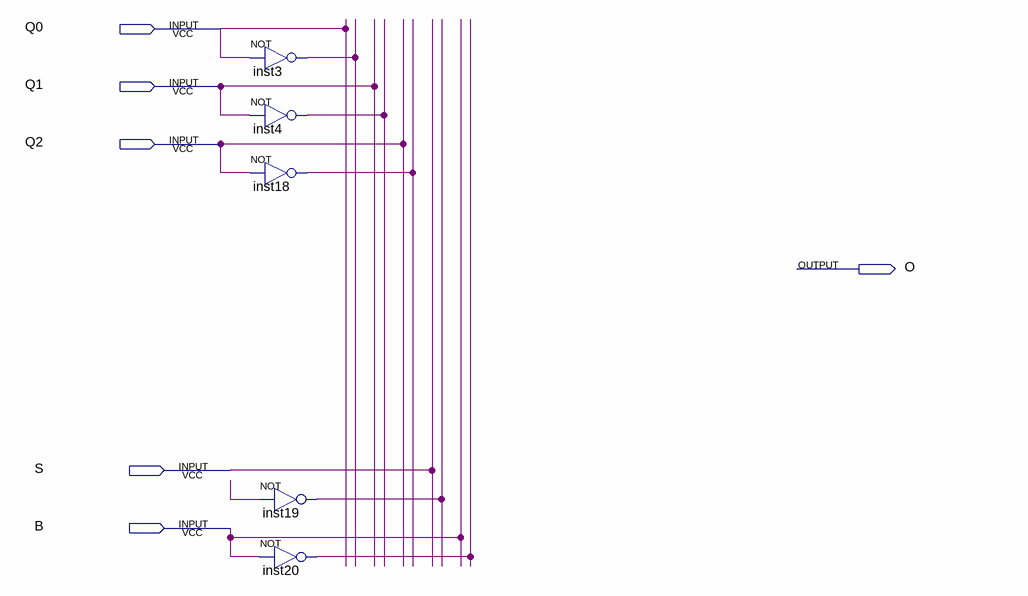
[diagram p0: schematic sheet]
// Quartus schematic logic_d0.bdf as structural Verilog: 5 symbols, 6 pins
module logic_d0 (
  input  Q0,
  input  Q1,
  input  Q2,
  input  S,
  input  B,
  output O
);

  wire inst3_out, inst4_out, inst18_out, inst19_out, inst20_out, undriven;

  not inst3 (inst3_out, Q0);
  not inst4 (inst4_out, Q1);
  not inst18 (inst18_out, Q2);
  not inst19 (inst19_out, undriven);
  not inst20 (inst20_out, B);
endmodule
